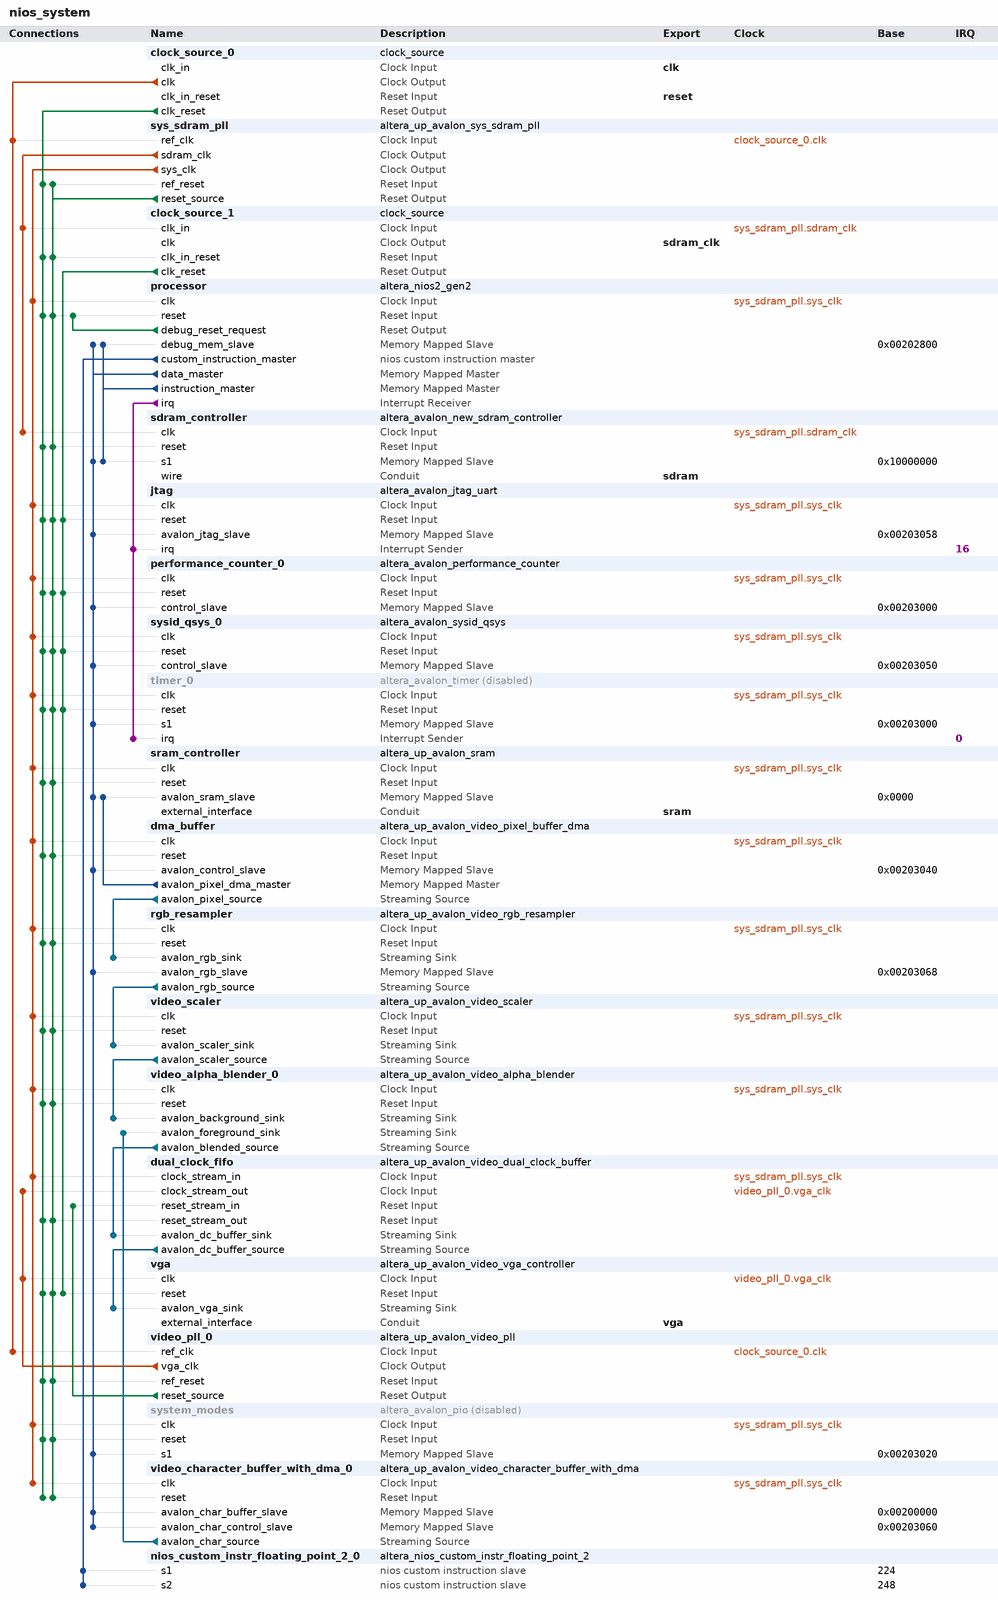
[diagram p0: system contents]
# Platform Designer (Qsys) system nios_system, Cyclone IV E EP4CE115F29C7
# Parameters at their usual value, and those the tool derives, are not listed.
package require -exact qsys 18.1
create_system nios_system
set_project_property DEVICE_FAMILY {Cyclone IV E}
set_project_property DEVICE EP4CE115F29C7

add_instance clock_source_0 clock_source 18.1
set_instance_parameter_value clock_source_0 clockFrequency 50000000

add_instance sys_sdram_pll altera_up_avalon_sys_sdram_pll 18.0
set_instance_parameter_value sys_sdram_pll CV_boards DE10-Standard
set_instance_parameter_value sys_sdram_pll gui_outclk 50.0
set_instance_parameter_value sys_sdram_pll gui_refclk 50.0

add_instance clock_source_1 clock_source 18.1
set_instance_parameter_value clock_source_1 clockFrequency 50000000

add_instance processor altera_nios2_gen2 18.1
set_instance_parameter_value processor dcache_size 4096
set_instance_parameter_value processor exceptionSlave sdram_controller.s1
set_instance_parameter_value processor icache_size 4096
set_instance_parameter_value processor impl Fast
set_instance_parameter_value processor resetSlave sdram_controller.s1

add_instance sdram_controller altera_avalon_new_sdram_controller 18.1
set_instance_parameter_value sdram_controller TAC 5.5
set_instance_parameter_value sdram_controller TRCD 20.0
set_instance_parameter_value sdram_controller TRP 20.0
set_instance_parameter_value sdram_controller casLatency 3
set_instance_parameter_value sdram_controller columnWidth 10
set_instance_parameter_value sdram_controller dataWidth 32
set_instance_parameter_value sdram_controller generateSimulationModel true
set_instance_parameter_value sdram_controller model single_Micron_MT48LC4M32B2_7_chip
set_instance_parameter_value sdram_controller numberOfBanks 4
set_instance_parameter_value sdram_controller numberOfChipSelects 1
set_instance_parameter_value sdram_controller powerUpDelay 100.0
set_instance_parameter_value sdram_controller refreshPeriod 15.625
set_instance_parameter_value sdram_controller rowWidth 13

add_instance jtag altera_avalon_jtag_uart 18.1
set_instance_parameter_value jtag simInteractiveOptions NO_INTERACTIVE_WINDOWS

add_instance performance_counter_0 altera_avalon_performance_counter 18.1
set_instance_parameter_value performance_counter_0 numberOfSections 3

add_instance sysid_qsys_0 altera_avalon_sysid_qsys 18.1
set_instance_parameter_value sysid_qsys_0 id 0

add_instance timer_0 altera_avalon_timer 18.1
set_instance_property timer_0 ENABLED false
set_instance_parameter_value timer_0 period 100
set_instance_parameter_value timer_0 periodUnits USEC

add_instance sram_controller altera_up_avalon_sram 18.0
set_instance_parameter_value sram_controller board DE2-115
set_instance_parameter_value sram_controller pixel_buffer true

add_instance dma_buffer altera_up_avalon_video_pixel_buffer_dma 18.0
set_instance_parameter_value dma_buffer addr_mode Consecutive
set_instance_parameter_value dma_buffer back_start_address 0
set_instance_parameter_value dma_buffer color_space {24-bit RGB}
set_instance_parameter_value dma_buffer image_height 240
set_instance_parameter_value dma_buffer image_width 320
set_instance_parameter_value dma_buffer start_address 0

add_instance rgb_resampler altera_up_avalon_video_rgb_resampler 18.0
set_instance_parameter_value rgb_resampler alpha 1023
set_instance_parameter_value rgb_resampler input_type {24-bit RGB}
set_instance_parameter_value rgb_resampler output_type {30-bit RGB}

add_instance video_scaler altera_up_avalon_video_scaler 18.0
set_instance_parameter_value video_scaler color_bits 10
set_instance_parameter_value video_scaler color_planes 3
set_instance_parameter_value video_scaler height_scaling 2
set_instance_parameter_value video_scaler width_in 320
set_instance_parameter_value video_scaler width_scaling 2

add_instance video_alpha_blender_0 altera_up_avalon_video_alpha_blender 18.0

add_instance dual_clock_fifo altera_up_avalon_video_dual_clock_buffer 18.0
set_instance_parameter_value dual_clock_fifo color_bits 10

add_instance vga altera_up_avalon_video_vga_controller 18.0
set_instance_parameter_value vga board DE2-115
set_instance_parameter_value vga resolution {VGA 640x480}

add_instance video_pll_0 altera_up_avalon_video_pll 18.0
set_instance_parameter_value video_pll_0 camera {5MP Digital Camera (THDB_D5M)}
set_instance_parameter_value video_pll_0 gui_refclk 50.0
set_instance_parameter_value video_pll_0 lcd {7" LCD on VEEK-MT and MTL/MTL2 Modules}

add_instance system_modes altera_avalon_pio 18.1
set_instance_property system_modes ENABLED false
set_instance_parameter_value system_modes direction Input
set_instance_parameter_value system_modes width 2

add_instance video_character_buffer_with_dma_0 altera_up_avalon_video_character_buffer_with_dma 18.0
set_instance_parameter_value video_character_buffer_with_dma_0 enable_transparency true

add_instance nios_custom_instr_floating_point_2_0 altera_nios_custom_instr_floating_point_2 18.1
set_instance_parameter_value nios_custom_instr_floating_point_2_0 arithmetic_present true
set_instance_parameter_value nios_custom_instr_floating_point_2_0 comparison_present true
set_instance_parameter_value nios_custom_instr_floating_point_2_0 conversion_present true
set_instance_parameter_value nios_custom_instr_floating_point_2_0 root_present true

# connections
add_connection clock_source_0.clk sys_sdram_pll.ref_clk clock
add_connection clock_source_0.clk video_pll_0.ref_clk clock
add_connection sys_sdram_pll.sdram_clk clock_source_1.clk_in clock
add_connection sys_sdram_pll.sdram_clk sdram_controller.clk clock
add_connection sys_sdram_pll.sys_clk dma_buffer.clk clock
add_connection sys_sdram_pll.sys_clk dual_clock_fifo.clock_stream_in clock
add_connection sys_sdram_pll.sys_clk jtag.clk clock
add_connection sys_sdram_pll.sys_clk performance_counter_0.clk clock
add_connection sys_sdram_pll.sys_clk processor.clk clock
add_connection sys_sdram_pll.sys_clk rgb_resampler.clk clock
add_connection sys_sdram_pll.sys_clk sram_controller.clk clock
add_connection sys_sdram_pll.sys_clk sysid_qsys_0.clk clock
add_connection sys_sdram_pll.sys_clk system_modes.clk clock
add_connection sys_sdram_pll.sys_clk timer_0.clk clock
add_connection sys_sdram_pll.sys_clk video_alpha_blender_0.clk clock
add_connection sys_sdram_pll.sys_clk video_character_buffer_with_dma_0.clk clock
add_connection sys_sdram_pll.sys_clk video_scaler.clk clock
add_connection video_pll_0.vga_clk dual_clock_fifo.clock_stream_out clock
add_connection video_pll_0.vga_clk vga.clk clock
add_connection clock_source_0.clk_reset clock_source_1.clk_in_reset reset
add_connection clock_source_0.clk_reset dma_buffer.reset reset
add_connection clock_source_0.clk_reset dual_clock_fifo.reset_stream_out reset
add_connection clock_source_0.clk_reset jtag.reset reset
add_connection clock_source_0.clk_reset performance_counter_0.reset reset
add_connection clock_source_0.clk_reset processor.reset reset
add_connection clock_source_0.clk_reset rgb_resampler.reset reset
add_connection clock_source_0.clk_reset sdram_controller.reset reset
add_connection clock_source_0.clk_reset sram_controller.reset reset
add_connection clock_source_0.clk_reset sys_sdram_pll.ref_reset reset
add_connection clock_source_0.clk_reset sysid_qsys_0.reset reset
add_connection clock_source_0.clk_reset system_modes.reset reset
add_connection clock_source_0.clk_reset timer_0.reset reset
add_connection clock_source_0.clk_reset vga.reset reset
add_connection clock_source_0.clk_reset video_alpha_blender_0.reset reset
add_connection clock_source_0.clk_reset video_character_buffer_with_dma_0.reset reset
add_connection clock_source_0.clk_reset video_pll_0.ref_reset reset
add_connection clock_source_0.clk_reset video_scaler.reset reset
add_connection clock_source_1.clk_reset jtag.reset reset
add_connection clock_source_1.clk_reset performance_counter_0.reset reset
add_connection clock_source_1.clk_reset sysid_qsys_0.reset reset
add_connection clock_source_1.clk_reset timer_0.reset reset
add_connection clock_source_1.clk_reset vga.reset reset
add_connection processor.debug_reset_request processor.reset reset
add_connection sys_sdram_pll.reset_source clock_source_1.clk_in_reset reset
add_connection sys_sdram_pll.reset_source dma_buffer.reset reset
add_connection sys_sdram_pll.reset_source dual_clock_fifo.reset_stream_out reset
add_connection sys_sdram_pll.reset_source jtag.reset reset
add_connection sys_sdram_pll.reset_source performance_counter_0.reset reset
add_connection sys_sdram_pll.reset_source processor.reset reset
add_connection sys_sdram_pll.reset_source rgb_resampler.reset reset
add_connection sys_sdram_pll.reset_source sdram_controller.reset reset
add_connection sys_sdram_pll.reset_source sram_controller.reset reset
add_connection sys_sdram_pll.reset_source sys_sdram_pll.ref_reset reset
add_connection sys_sdram_pll.reset_source sysid_qsys_0.reset reset
add_connection sys_sdram_pll.reset_source system_modes.reset reset
add_connection sys_sdram_pll.reset_source timer_0.reset reset
add_connection sys_sdram_pll.reset_source vga.reset reset
add_connection sys_sdram_pll.reset_source video_alpha_blender_0.reset reset
add_connection sys_sdram_pll.reset_source video_character_buffer_with_dma_0.reset reset
add_connection sys_sdram_pll.reset_source video_pll_0.ref_reset reset
add_connection sys_sdram_pll.reset_source video_scaler.reset reset
add_connection video_pll_0.reset_source dual_clock_fifo.reset_stream_in reset
add_connection dma_buffer.avalon_pixel_dma_master sram_controller.avalon_sram_slave avalon
set_connection_parameter_value dma_buffer.avalon_pixel_dma_master/sram_controller.avalon_sram_slave baseAddress 0x0000
add_connection processor.data_master dma_buffer.avalon_control_slave avalon
set_connection_parameter_value processor.data_master/dma_buffer.avalon_control_slave baseAddress 0x00203040
add_connection processor.data_master jtag.avalon_jtag_slave avalon
set_connection_parameter_value processor.data_master/jtag.avalon_jtag_slave baseAddress 0x00203058
add_connection processor.data_master performance_counter_0.control_slave avalon
set_connection_parameter_value processor.data_master/performance_counter_0.control_slave baseAddress 0x00203000
add_connection processor.data_master processor.debug_mem_slave avalon
set_connection_parameter_value processor.data_master/processor.debug_mem_slave baseAddress 0x00202800
add_connection processor.data_master rgb_resampler.avalon_rgb_slave avalon
set_connection_parameter_value processor.data_master/rgb_resampler.avalon_rgb_slave baseAddress 0x00203068
add_connection processor.data_master sdram_controller.s1 avalon
set_connection_parameter_value processor.data_master/sdram_controller.s1 baseAddress 0x10000000
add_connection processor.data_master sram_controller.avalon_sram_slave avalon
set_connection_parameter_value processor.data_master/sram_controller.avalon_sram_slave baseAddress 0x0000
add_connection processor.data_master sysid_qsys_0.control_slave avalon
set_connection_parameter_value processor.data_master/sysid_qsys_0.control_slave baseAddress 0x00203050
add_connection processor.data_master system_modes.s1 avalon
set_connection_parameter_value processor.data_master/system_modes.s1 baseAddress 0x00203020
add_connection processor.data_master timer_0.s1 avalon
set_connection_parameter_value processor.data_master/timer_0.s1 baseAddress 0x00203000
add_connection processor.data_master video_character_buffer_with_dma_0.avalon_char_buffer_slave avalon
set_connection_parameter_value processor.data_master/video_character_buffer_with_dma_0.avalon_char_buffer_slave baseAddress 0x00200000
add_connection processor.data_master video_character_buffer_with_dma_0.avalon_char_control_slave avalon
set_connection_parameter_value processor.data_master/video_character_buffer_with_dma_0.avalon_char_control_slave baseAddress 0x00203060
add_connection processor.instruction_master processor.debug_mem_slave avalon
set_connection_parameter_value processor.instruction_master/processor.debug_mem_slave baseAddress 0x00202800
add_connection processor.instruction_master sdram_controller.s1 avalon
set_connection_parameter_value processor.instruction_master/sdram_controller.s1 baseAddress 0x10000000
add_connection dma_buffer.avalon_pixel_source rgb_resampler.avalon_rgb_sink avalon_streaming
add_connection dual_clock_fifo.avalon_dc_buffer_source vga.avalon_vga_sink avalon_streaming
add_connection rgb_resampler.avalon_rgb_source video_scaler.avalon_scaler_sink avalon_streaming
add_connection video_alpha_blender_0.avalon_blended_source dual_clock_fifo.avalon_dc_buffer_sink avalon_streaming
add_connection video_character_buffer_with_dma_0.avalon_char_source video_alpha_blender_0.avalon_foreground_sink avalon_streaming
add_connection video_scaler.avalon_scaler_source video_alpha_blender_0.avalon_background_sink avalon_streaming
add_connection processor.irq jtag.irq interrupt
set_connection_parameter_value processor.irq/jtag.irq irqNumber 16
add_connection processor.irq timer_0.irq interrupt
set_connection_parameter_value processor.irq/timer_0.irq irqNumber 0
add_connection processor.custom_instruction_master nios_custom_instr_floating_point_2_0.s1 nios_custom_instruction
set_connection_parameter_value processor.custom_instruction_master/nios_custom_instr_floating_point_2_0.s1 CIName nios_custom_instr_floating_point_2_0
set_connection_parameter_value processor.custom_instruction_master/nios_custom_instr_floating_point_2_0.s1 baseAddress 224
add_connection processor.custom_instruction_master nios_custom_instr_floating_point_2_0.s2 nios_custom_instruction
set_connection_parameter_value processor.custom_instruction_master/nios_custom_instr_floating_point_2_0.s2 CIName nios_custom_instr_floating_point_2_0_1
set_connection_parameter_value processor.custom_instruction_master/nios_custom_instr_floating_point_2_0.s2 baseAddress 248

# exported interfaces
add_interface clk clock sink
set_interface_property clk EXPORT_OF clock_source_0.clk_in
add_interface reset reset sink
set_interface_property reset EXPORT_OF clock_source_0.clk_in_reset
add_interface sdram conduit end
set_interface_property sdram EXPORT_OF sdram_controller.wire
add_interface sdram_clk clock source
set_interface_property sdram_clk EXPORT_OF clock_source_1.clk
add_interface sram conduit end
set_interface_property sram EXPORT_OF sram_controller.external_interface
add_interface vga conduit end
set_interface_property vga EXPORT_OF vga.external_interface

set_interconnect_requirement {$system} qsys_mm.clockCrossingAdapter HANDSHAKE
set_interconnect_requirement {$system} qsys_mm.enableEccProtection FALSE
set_interconnect_requirement {$system} qsys_mm.insertDefaultSlave FALSE
set_interconnect_requirement {$system} qsys_mm.maxAdditionalLatency 1

save_system nios_system.qsys
